# EAGLE design PIC32_v1 (EAGLE 9.0.0)
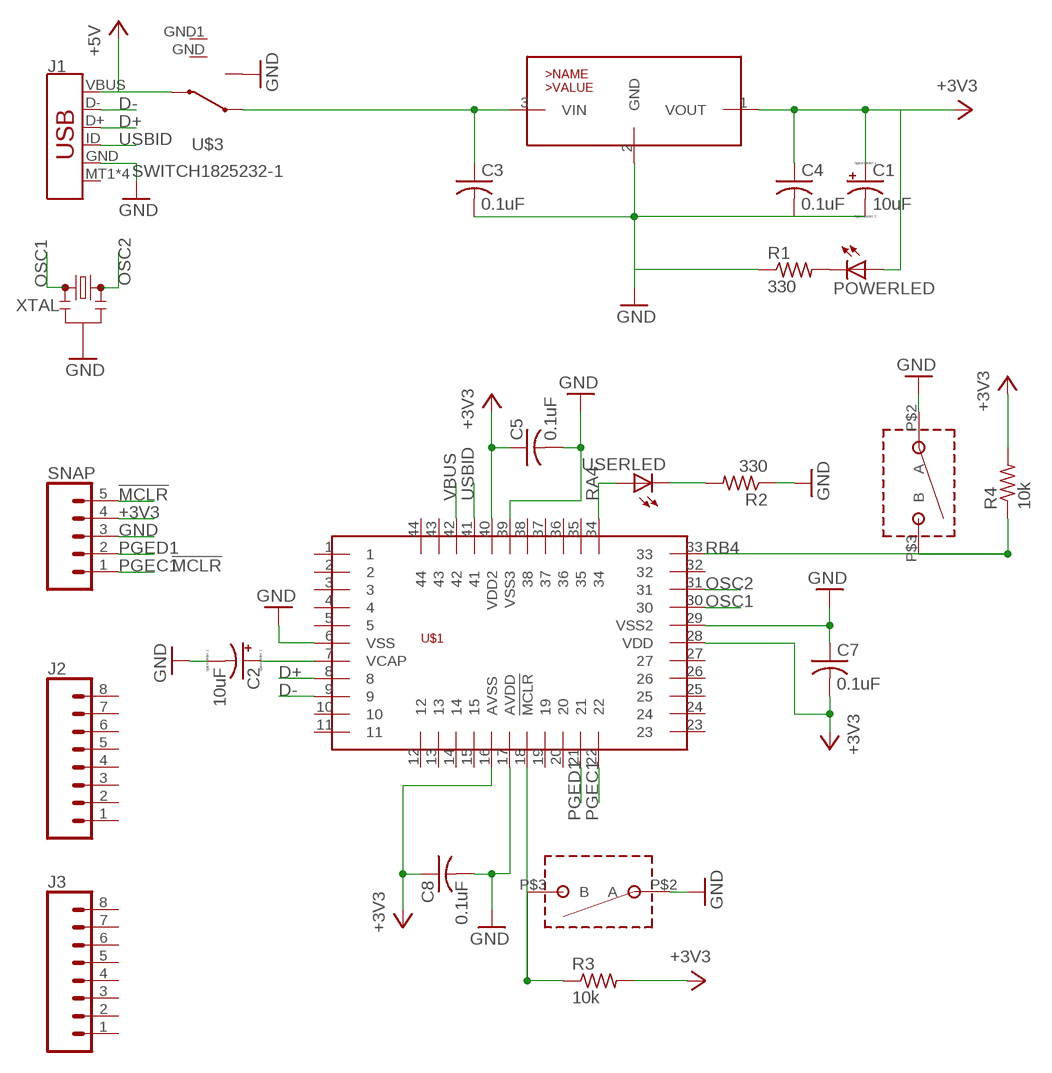
[diagram p0: schematic, sheet 1]

## Parts
C1  10uF  CPOL-USTAP5-50  [TAP5-50]
C2  10uF  CPOL-USTAP5-50  [TAP5-50]
C3  0.1uF  C-US025-024X044  [C025-024X044]
C4  0.1uF  C-US025-024X044  [C025-024X044]
C5  0.1uF  C-US025-024X044  [C025-024X044]
C7  0.1uF  C-US025-024X044  [C025-024X044]
C8  0.1uF  C-US025-024X044  [C025-024X044]
J1  USB_MICRO-B_SMT  [USB-MICROB]
J2  CONN_08"  [1X08]
J3  CONN_08"  [1X08]
POWERLED  LED3MM  [LED3MM]
R1  330  R-US_0309/12  [0309/12]
R2  330  R-US_0309/12  [0309/12]
R3  10k  R-US_0309/12  [0309/12]
R4  10k  R-US_0309/12  [0309/12]
SNAP  CONN_05  [1X05]
U$1  PIC32MX170F256D-TQFP44  [TQFP44]
U$2  PUSHBUTTON  [PBEVQ-11A07K]
U$3  SWITCH1825232-1  [1825232-1]
U$4  PUSHBUTTON  [PBEVQ-11A07K]
USERLED  LED3MM  [LED3MM]
VREGULATOR  L4931-TO92  [TO92]
XTAL  RESONATORPTH-7.6X3.8  [RESONATOR-PTH-7.6X3.8]

## Nets
!MCLR: R3.1 SNAP.5 U$1.18(!MCLR) U$4.P$3(B)
+3V3: C1.+ C4.1 C5.1 C7.2 C8.1 POWERLED.A R3.2 R4.2 SNAP.4 U$1.16(AVSS) U$1.28(VDD) U$1.40(VDD2) VREGULATOR.1(VOUT)
+5V: J1.VBUS U$3.2
D+: J1.D+ U$1.8
D-: J1.D- U$1.9
GND: C1.- C2.- C3.2 C4.2 C5.2 C7.1 C8.2 J1.GND R1.1 R2.1 SNAP.3 U$1.6(VSS) U$1.17(AVDD) U$1.29(VSS2) U$1.39(VSS3) U$2.P$2(A) U$3.1 U$4.P$2(A) VREGULATOR.2(GND) XTAL.2
N$1: POWERLED.K(C) R1.2
N$2: R2.2 USERLED.K(C)
N$4: C3.1 U$3.3 VREGULATOR.3(VIN)
N$5: C2.+ U$1.7(VCAP)
OSC1: U$1.30 XTAL.1
OSC2: U$1.31 XTAL.3
PGEC1: SNAP.1 U$1.22
PGED1: SNAP.2 U$1.21
RA4: U$1.34 USERLED.A
RB4: R4.1 U$1.33 U$2.P$3(B)
USBID: J1.ID U$1.41
VBUS: U$1.42
Unconnected: J1.MT1(SHIELD) J1.MT2(SHIELD) J1.P$1(SHIELD) J1.P$2(SHIELD) J2.1 J2.2 J2.3 J2.4 J2.5 J2.6 J2.7 J2.8 J3.1 J3.2 J3.3 J3.4 J3.5 J3.6 J3.7 J3.8 U$1.1 U$1.2 U$1.3 U$1.4 U$1.5 U$1.10 U$1.11 U$1.12 U$1.13 U$1.14 U$1.15 U$1.19 U$1.20 U$1.23 U$1.24 U$1.25 U$1.26 U$1.27 U$1.32 U$1.35 U$1.36 U$1.37 U$1.38 U$1.43 U$1.44 U$3.GND U$3.GND1

## Library data of the parts
C1 C2 = PIC32:CPOL-US: POLARIZED CAPACITOR, American symbol
C3-C5 C7 C8 = PIC32:C-US: CAPACITOR, American symbol
J1 = PIC32:USB_MICRO-B: USB Type Micro-B Connector Male/female and PTH/SMT variants SparkFun Products: SparkFun microB USB Breakout <https://www.sparkfun.com/products/12035> SparkFun USB microB Plug Breakout <https://www.sparkfun.com/products/10031> SparkFun ESP8266 Thing <https://www.sparkfun.com/products/13231>; PROD_ID: CONN-09505; SF_ID: PRT-08533
J2 J3 = SparkFun-Connectors:CONN_08: Multi connection point. Often used as Generic Header-pin footprint for 0.1 inch spaced/style header connections On any of the 0.1 inch spaced packages, you can populate with these: Break Away Headers - Straight <https://www.sparkfun.com/products/116> (PRT-00116) Break Away Male Headers - Right Angle <https://www.sparkfun.com/products/553> (PRT-00553) Female Headers <https://www.sparkfun.com/products/115> (PRT-00115) Break Away Headers - Machine Pin <https://www.sparkfun.com/products/117> (PRT-00117) Break Away Female Headers - Swiss Machine Pin <https://www.sparkfun.com/products/743> (PRT-00743) Arduino Stackable Header - 8 Pin <https://www.sparkfun.com/products/9279> (PRT-09279) For SCREWTERMINALS and SPRING TERMINALS visit here: Screw Terimnals on SparkFun.com <https://www.sparkfun.com/search/results?term=Screw+Terminals> (5mm/3.5mm/2.54mm spacing) This device is also useful as a general connection point to wire up your design to another part of your project. Our various solder wires solder well into these plated through hole pads. Hook-Up Wire - Assortment (Stranded, 22 AWG) <https://www.sparkfun.com/products/11375> (PRT-11375) Hook-Up Wire - Assortment (Solid Core, 22 AWG) <https://www.sparkfun.com/products/11367> (PRT-11367) View the entire wire category on our website here <https://www.sparkfun.com/categories/141> Special notes: Molex polarized connector foot print use with SKU : PRT-08231 with associated crimp pins and housings. 1MM SMD Version SKU: PRT-10208 NOTES ON THE VARIANTS LOCK and LOCK_LONGPADS... This footprint was designed to help hold the alignment of a through-hole component (i.e. 6-pin header) while soldering it into place. You may notice that each hole has been shifted either up or down by 0.005 of an inch from it's more standard position (which is a perfectly straight line). This slight alteration caused the pins (the squares in the middle) to touch the edges of the holes. Because they are alternating, it causes a "brace" to hold the component in place. 0.005 has proven to be the perfect amount of "off-center" position when using our standard breakaway headers. Although looks a little odd when you look at the bare footprint, once you have a header in there, the alteration is very hard to notice. Also,if you push a header all the way into place, it is covered up entirely on the bottom side.; PROD_ID: CONN-08438
POWERLED USERLED = PIC32:LED: LED OSRAM: - CHIPLED LG R971, LG N971, LY N971, LG Q971, LY Q971, LO R971, LY R971 LH N974, LH R974 LS Q976, LO Q976, LY Q976 LO Q996 - Hyper CHIPLED LW Q18S LB Q993, LB Q99A, LB R99A - SideLED LS A670, LO A670, LY A670, LG A670, LP A670 LB A673, LV A673, LT A673, LW A673 LH A674 LY A675 LS A676, LA A676, LO A676, LY A676, LW A676 LS A679, LY A679, LG A679 - Hyper Micro SIDELED® LS Y876, LA Y876, LO Y876, LY Y876 LT Y87S - SmartLED LW L88C, LW L88S LB L89C, LB L89S, LG L890 LS L89K, LO L89K, LY L89K LS L896, LA L896, LO L896, LY L896 - TOPLED LS T670, LO T670, LY T670, LG T670, LP T670 LSG T670, LSP T670, LSY T670, LOP T670, LYG T670 LG T671, LOG T671, LSG T671 LB T673, LV T673, LT T673, LW T673 LH T674 LS T676, LA T676, LO T676, LY T676, LB T676, LH T676, LSB T676, LW T676 LB T67C, LV T67C, LT T67C, LS T67K, LO T67K, LY T67K, LW E67C LS E67B, LA E67B, LO E67B, LY E67B, LB E67C, LV E67C, LT E67C LW T67C LS T679, LY T679, LG T679 LS T770, LO T770, LY T770, LG T770, LP T770 LB T773, LV T773, LT T773, LW T773 LH T774 LS E675, LA E675, LY E675, LS T675 LS T776, LA T776, LO T776, LY T776, LB T776 LHGB T686 LT T68C, LB T68C - Hyper Mini TOPLED® LB M676 - Mini TOPLED Santana® LG M470 LS M47K, LO M47K, LY M47K Source: http://www.osram.convergy.de LUXEON: - LUMILED® LXK2-PW12-R00, LXK2-PW12-S00, LXK2-PW14-U00, LXK2-PW14-V00 LXK2-PM12-R00, LXK2-PM12-S00, LXK2-PM14-U00 LXK2-PE12-Q00, LXK2-PE12-R00, LXK2-PE12-S00, LXK2-PE14-T00, LXK2-PE14-U00 LXK2-PB12-K00, LXK2-PB12-L00, LXK2-PB12-M00, LXK2-PB14-N00, LXK2-PB14-P00, LXK2-PB14-Q00 LXK2-PR12-L00, LXK2-PR12-M00, LXK2-PR14-Q00, LXK2-PR14-R00 LXK2-PD12-Q00, LXK2-PD12-R00, LXK2-PD12-S00 LXK2-PH12-R00, LXK2-PH12-S00 LXK2-PL12-P00, LXK2-PL12-Q00, LXK2-PL12-R00 Source: www.luxeon.com KINGBRIGHT: KA-3528ASYC Source: www.kingbright.com
R1-R4 = PIC32:R-US_: RESISTOR, American symbol
SNAP = SparkFun-Connectors:CONN_05: Multi connection point. Often used as Generic Header-pin footprint for 0.1 inch spaced/style header connections On any of the 0.1 inch spaced packages, you can populate with these: Break Away Headers - Straight <https://www.sparkfun.com/products/116> (PRT-00116) Break Away Male Headers - Right Angle <https://www.sparkfun.com/products/553> (PRT-00553) Female Headers <https://www.sparkfun.com/products/115> (PRT-00115) Break Away Headers - Machine Pin <https://www.sparkfun.com/products/117> (PRT-00117) Break Away Female Headers - Swiss Machine Pin <https://www.sparkfun.com/products/743> (PRT-00743) For SCREWTERMINALS and SPRING TERMINALS visit here: Screw Terimnals on SparkFun.com <https://www.sparkfun.com/search/results?term=Screw+Terminals> (5mm/3.5mm/2.54mm spacing) This device is also useful as a general connection point to wire up your design to another part of your project. Our various solder wires solder well into these plated through hole pads. Hook-Up Wire - Assortment (Stranded, 22 AWG) <https://www.sparkfun.com/products/11375> (PRT-11375) Hook-Up Wire - Assortment (Solid Core, 22 AWG) <https://www.sparkfun.com/products/11367> (PRT-11367) View the entire wire category on our website here <https://www.sparkfun.com/categories/141> Special notes: Molex polarized connector foot print use with SKU : PRT-08231 with associated crimp pins and housings. 1MM SMD Version SKU: PRT-10208
U$1 = PIC32:PIC32MX170F256D-TQFP44
U$2 U$4 = PIC32:PUSHBUTTON
U$3 = PIC32:SWITCH1825232-1; AVAILABILITY: Unavailable; COMMENT: 1825232-1; DESCRIPTION: Switch Slide ON None ON SPDT Side Slide 0.2A 30VDC 10000Cycle PC Pins Bracket Mount/Through Hole; EU_ROHS_COMPLIANCE: Compliant; MF: TE Connectivity; MP: 1825232-1; PACKAGE: None; PRICE: None; TE_PURCHASE_URL: https://www.te.com/usa-en/product-1825232-1.html?te_bu=Cor&te_type=disp&te_campaign=seda_glo_cor-seda-global-disp-prtnr-fy19-seda-model-bom-cta_sma-317_1&elqCampaignId=32493
VREGULATOR = PIC32:L4931-TO92
XTAL = PIC32:RESONATOR: Resonators (Generic) Ceramic resonators are clock-generating components, often used to control timing in microcontrollers. They usually have 3 pins: two pins for oscillation, and one pin for ground. Compared to crystals, resonators have worse tolerance, but are usually much cheaper. Plus, they have built-in load capacitors! These devices are used on boards like the Arduino Pro 8MHz <https://www.sparkfun.com/products/11114> and Arduino Pro 16MHz <https://www.sparkfun.com/products/11113>.

## Board
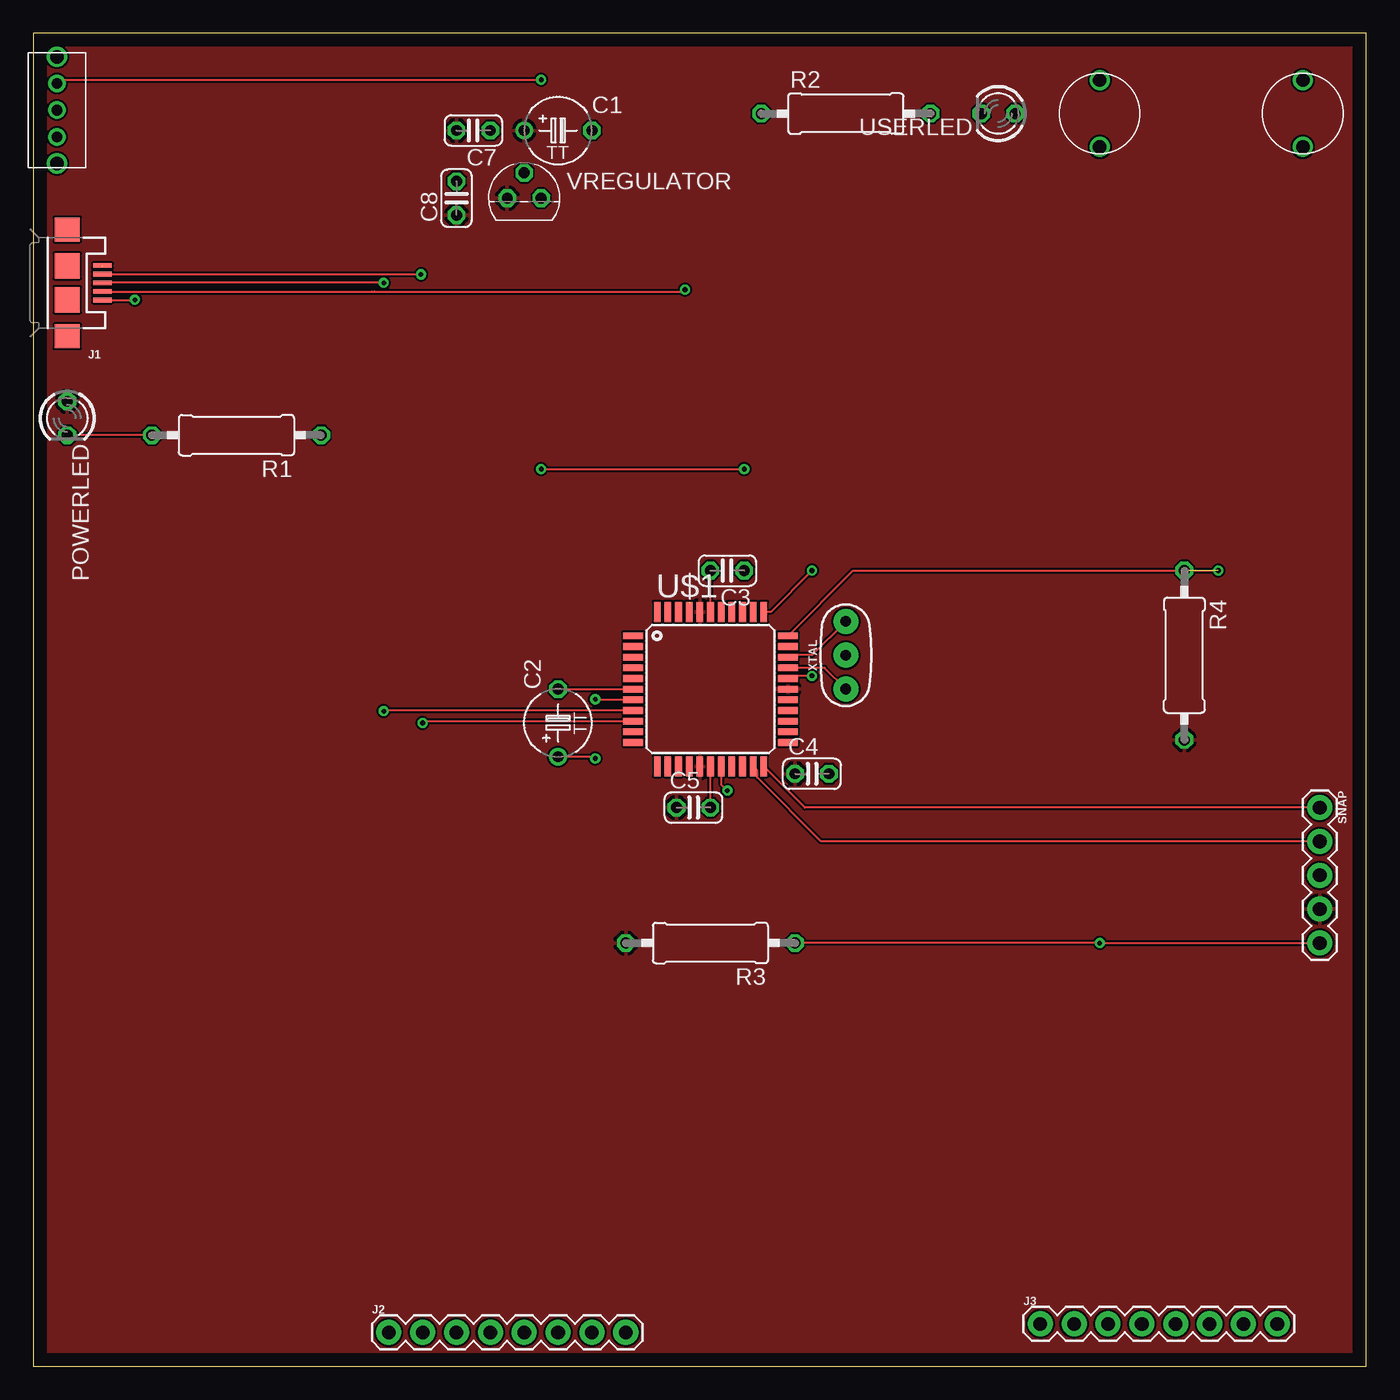
[diagram p1: board, top side]
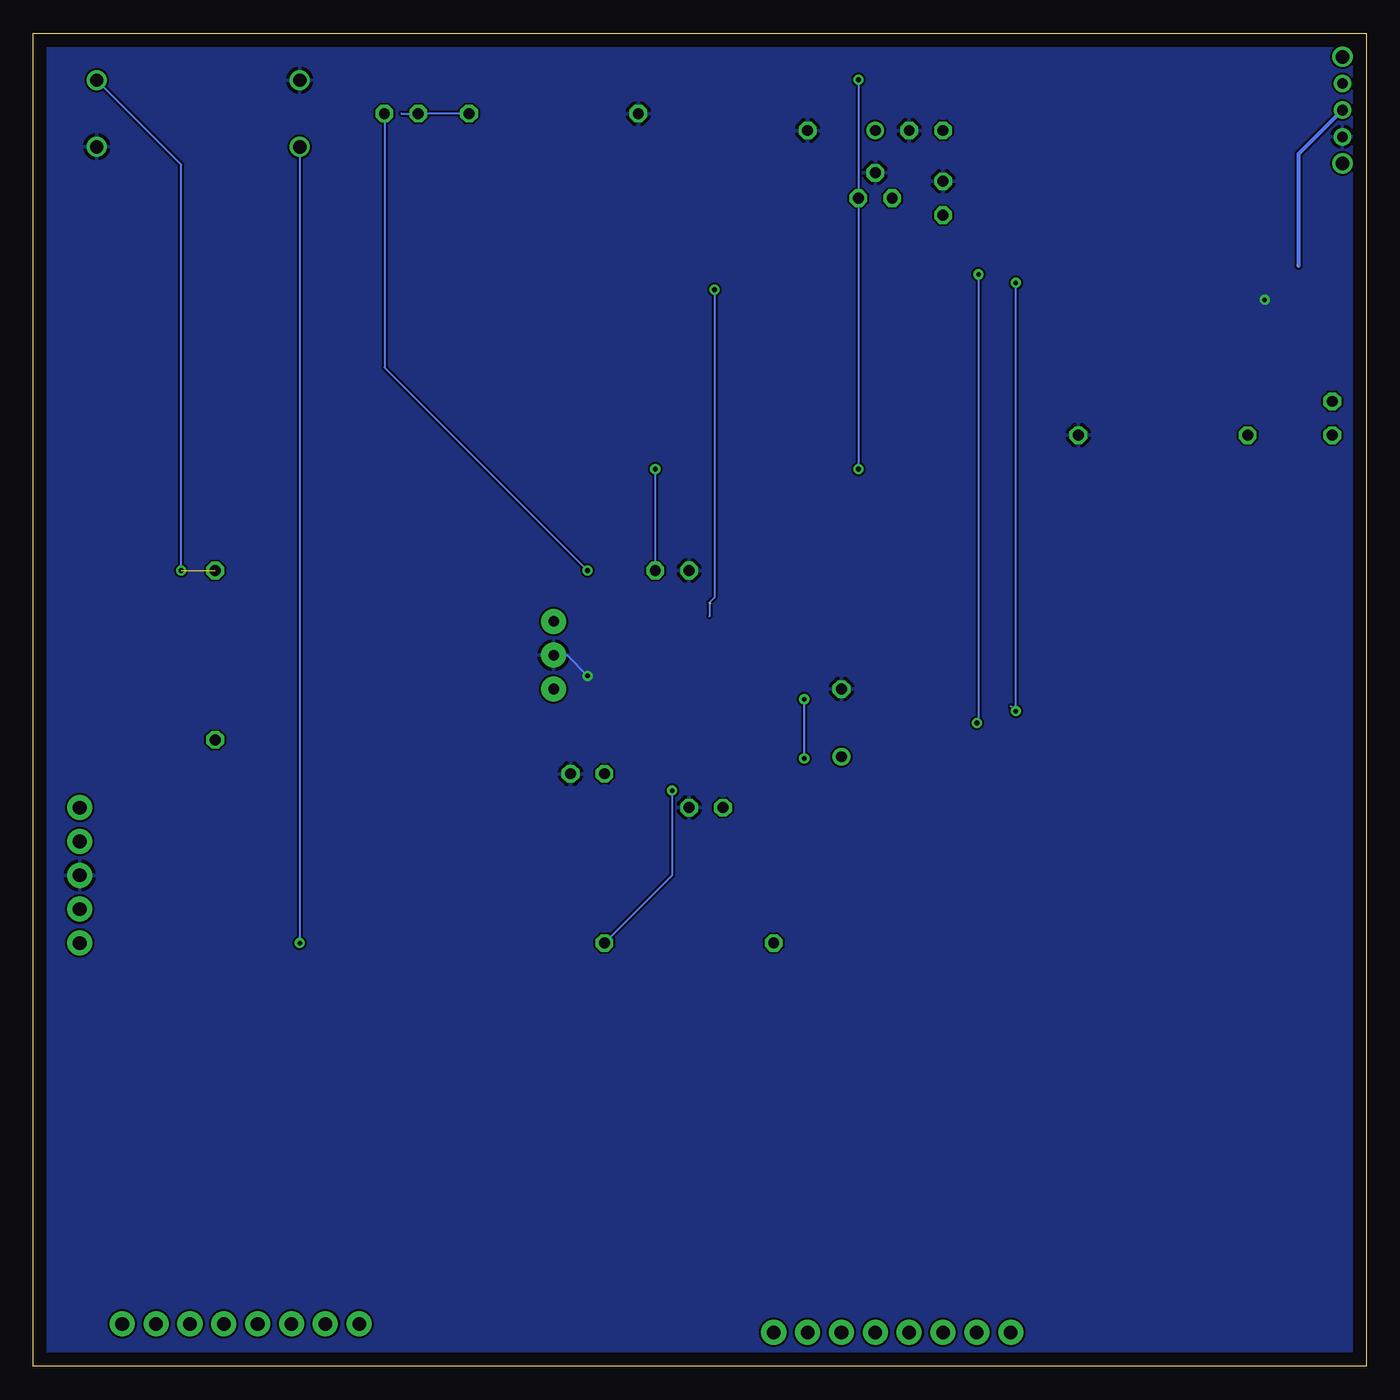
[diagram p2: board, bottom side, seen from below]

Size 100 x 100 mm. Coordinates in mm from the lower left corner, seen from the top.
Outline: 0,0 100,0 100,100 0,100 0,0
Copper layers (1*16): Top 0.035mm / dielectric 1.5mm / Bottom 0.035mm
Design rules "default": minimum track width 6mil, minimum drill 0.35mm, track to track 6mil, track to pad 6mil, pad to pad 6mil, via to via 6mil, smd to smd 6mil, copper to edge 40mil, drill to drill 6mil, minimum pad ring 10mil, minimum via ring 8mil, stop-mask expansion 4mil, vias tented up to drill 0mil, thermal gap 10mil

### Footprints (pad centres in the part's own frame; a part is rotated, then mirrored left to right if it is on the bottom)
TAP5-50 = drill 0.813: + -2.54,0 | drill 0.813 octagon: - 2.54,0
C025-024X044 = drill 0.813 octagon: 1 -1.27,0; 2 1.27,0
USB-MICROB = smd 1.4 x 0.35: D+ -2.65,0; D- -2.65,-0.65; GND -2.65,1.3; ID -2.65,0.65; VBUS -2.65,-1.3 | smd 1.9 x 1.8: MT1 0,-4; MT2 0,4 | smd 1.9 x 1.9: P$1 0,-1.27; P$2 0,1.27
1X08 = drill 1.016 pad 1.88: 1 0,0; 2 2.54,0; 3 5.08,0; 4 7.62,0; 5 10.16,0; 6 12.7,0; 7 15.24,0; 8 17.78,0
LED3MM = drill 0.813 octagon: A -1.27,0; K 1.27,0
0309/12 = drill 0.813 octagon: 1 -6.35,0; 2 6.35,0
1X05 = drill 1.016 pad 1.88: 1 0,0; 2 2.54,0; 3 5.08,0; 4 7.62,0; 5 10.16,0
TQFP44 = smd 1.5 x 0.5: 1 -5.8,4; 2 -5.8,3.2; 3 -5.8,2.4; 4 -5.8,1.6; 5 -5.8,0.8; 6 -5.8,0; 7 -5.8,-0.8; 8 -5.8,-1.6; 9 -5.8,-2.4; 10 -5.8,-3.2; 11 -5.8,-4; 23 5.8,-4; 24 5.8,-3.2; 25 5.8,-2.4; 26 5.8,-1.6; 27 5.8,-0.8; 28 5.8,0; 29 5.8,0.8; 30 5.8,1.6; 31 5.8,2.4; 32 5.8,3.2; 33 5.8,4 | smd 0.5 x 1.5: 12 -4,-5.8; 13 -3.2,-5.8; 14 -2.4,-5.8; 15 -1.6,-5.8; 16 -0.8,-5.8; 17 0,-5.8; 18 0.8,-5.8; 19 1.6,-5.8; 20 2.4,-5.8; 21 3.2,-5.8; 22 4,-5.8; 34 4,5.8; 35 3.2,5.8; 36 2.4,5.8; 37 1.6,5.8; 38 0.8,5.8; 39 0,5.8; 40 -0.8,5.8; 41 -1.6,5.8; 42 -2.4,5.8; 43 -3.2,5.8; 44 -4,5.8
PBEVQ-11A07K = drill 1: P$2 -2.5,0; P$3 2.5,0
1825232-1 = drill 0.8: 1 -2,0; 2 0,0; 3 2,0 | drill 1: GND -4,0; GND1 4,0
TO92 = drill 0.813 octagon: 1 -1.27,0; 2 0,1.905; 3 1.27,0
RESONATOR-PTH-7.6X3.8 = drill 0.8 pad 1.88: 1 -2.54,0; 2 0,0; 3 2.54,0

### Placement (x,y rotation side)
C1  39.37,92.71 0 top
C2  39.37,48.26 90 top
C3  52.07,59.69 180 top
C4  58.42,44.45 0 top
C5  49.53,41.91 0 top
C7  33.02,92.71 180 top
C8  31.75,87.63 90 top
J1  2.54,81.28 180 top
J2  26.67,2.54 0 top
J3  75.55,3.17 0 top
POWERLED  2.54,71.12 270 top
R1  15.24,69.85 180 top
R2  60.96,93.98 0 top
R3  50.8,31.75 180 top
R4  86.36,53.34 270 top
SNAP  96.52,41.91 270 top
U$1  50.8,50.8 0 top
U$2  95.25,93.98 90 top
U$3  1.78,94.23 90 top
U$4  80.01,93.98 270 top
USERLED  72.39,93.98 180 top
VREGULATOR  36.83,87.63 0 top
XTAL  60.96,53.34 90 top

### Tracks (layer width: path | path; a pad name or v marks a point on that pad's centre or on a via)
!MCLR  (via drill 0.35)
  Top 0.152: R3.1 v80.01,31.75 SNAP.5 | U$1.18 51.6,43.65 v52.07,43.18
  Bottom 0.152: U$4.P$3 v80.01,31.75 | v52.07,43.18 52.07,36.83 R3.1
+3V3
  pour Top: -3.81,102.87 101.6,102.87 104.14,100.33 104.14,-7.62 -5.08,-7.62 -5.08,101.6
+5V  (1 unrouted)
  Bottom 0.305: U$3.2 5.08,90.93 5.08,82.55
D+  (via drill 0.35)
  Top 0.152: U$1.8 26.34,49.2 v26.29,49.15 | v26.29,81.28 J1.D+
  Bottom 0.152: 26.67,49.53 v26.29,49.15 v26.29,81.28
D-  (via drill 0.35)
  Top 0.152: J1.D- 29.07,81.93 v29.08,81.92 | v29.21,48.26 29.35,48.4 U$1.9
  Bottom 0.152: v29.08,81.92 29.08,48.39 v29.21,48.26
GND  (via drill 0.35)
  Top 0.152: C2.- U$1.6 | U$1.39 C3.2 | J1.GND 7.59,79.98 v7.62,80.01 | C5.2 U$1.17 | v58.42,51.79 56.79,51.79 U$1.29
  Bottom 0.152: XTAL.2 59.97,53.34 v58.42,51.79
  pour Bottom: -2.54,105.41 105.41,105.41 107.95,102.87 107.95,44.45 109.22,43.18 109.22,-1.27 101.6,-8.89 -1.27,-8.89 -2.54,-10.16 -7.62,-5.08 -7.62,99.06 -2.54,104.14
N$1
  Top 0.152: R1.2 POWERLED.K
N$2
  Bottom 0.152: R2.2 USERLED.K 72.39,93.98
N$4  (via drill 0.35)
  Top 0.152: U$3.3 2.06,96.52 v38.1,96.52 | v38.1,67.31 v53.34,67.31
  Bottom 0.152: v38.1,96.52 VREGULATOR.3 v38.1,67.31 | v53.34,67.31 C3.1
N$5  (via drill 0.35)
  Top 0.152: U$1.7 42.2,50 v42.16,50.04 | v42.16,45.59 42.04,45.72 C2.+
  Bottom 0.152: v42.16,50.04 v42.16,45.59
OSC1
  Top 0.152: XTAL.1 59.36,52.4 U$1.30
OSC2
  Top 0.152: XTAL.3 58.42,53.34 56.74,53.34 U$1.31
PGEC1
  Top 0.152: SNAP.1 57.89,41.91 U$1.22
PGED1
  Top 0.152: U$1.21 54.32,44.68 54.32,44.16 59.11,39.37 SNAP.2
RA4  (via drill 0.35)
  Top 0.152: v58.42,59.69 55.33,56.6 U$1.34
  Bottom 0.152: USERLED.A 73.66,74.93 v58.42,59.69
RB4  (via drill 0.35)  (1 unrouted)
  Top 0.152: U$1.33 61.49,59.69 v88.9,59.69
  Bottom 0.152: v88.9,59.69 88.9,90.13 U$2.P$3
USBID  (via drill 0.35)  (1 unrouted)
  Top 0.152: J1.ID 25.4,80.63 25.58,80.63 48.75,80.63 v48.9,80.77 48.9,80.57 | 49.2,57.23 U$1.41
  Bottom 0.152: v48.9,80.77 48.9,57.66 49.28,57.28 49.28,56.26